# Altium project TTT4280_PCB.PrjPcb
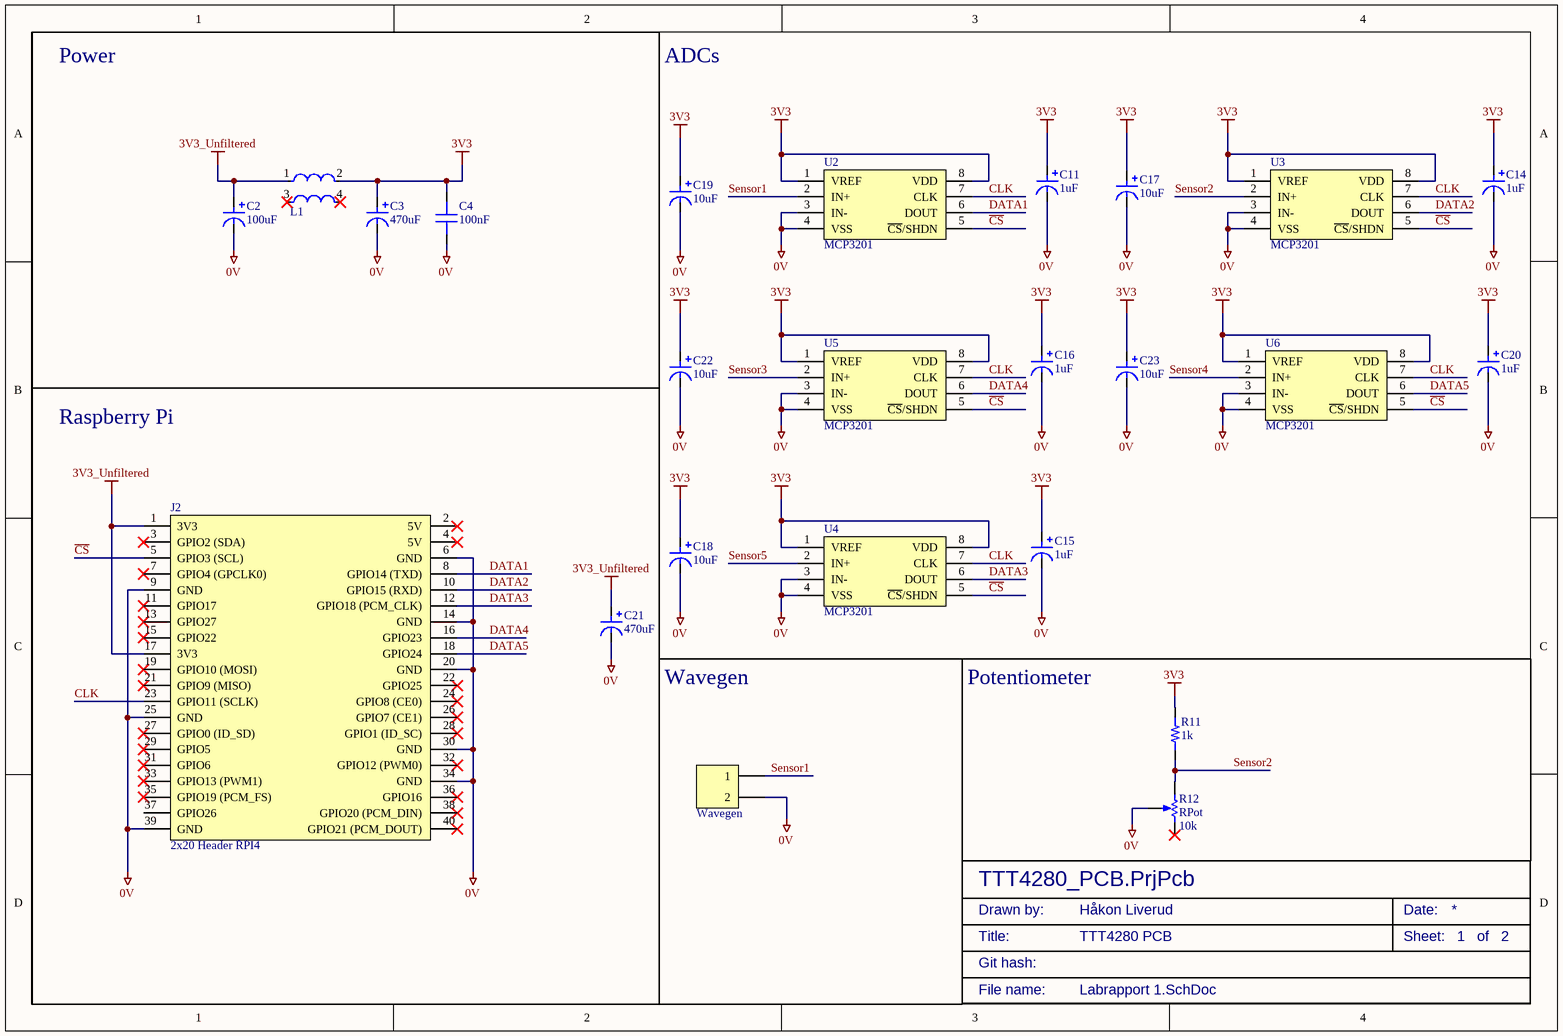
[diagram p0: Labrapport 1.SchDoc]

2 sheets, 75 parts. Net scope: global (net labels, ports and power ports of the same name join across sheets).
Board file: PCB.PcbDoc
Sheets:
  Labrapport 1.SchDoc
  Main.SchDoc

## Sheet Labrapport 1.SchDoc: TTT4280 Skjematikk
size A4; DocumentNumber: 1; SheetNumber: 1; SheetTotal: 2; DocumentTitle: TTT4280 PCB; ProjectEngineer: Håkon Liverud

### Parts
(Parts that share a designator on the sheet are numbered #1, #2 ... from top to bottom, then left to right.)
C2#1  100uF  [CTHT 5MM]
C3#1  470uF  [CTHT 8mm]
C4#1  100nF  [C TDK Film 7.3x2.5x6.5mm]
C11#1  1uF  [CTHT 4MM]
C14#1  1uF  [CTHT 4MM]
C15#1  1uF  [CTHT 4MM]
C16#1  1uF  [CTHT 4MM]
C17#1  10uF  [CTHT 4MM]
C18#1  10uF  [CTHT 4MM]
C19#1  10uF  [CTHT 4MM]
C20#1  1uF  [CTHT 4MM]
C21#1  470uF  [CTHT 8mm]
C22#1  10uF  [CTHT 4MM]
C23#1  10uF  [CTHT 4MM]
J2#1  2x20 Header RPI4  [HDRV40W87P254_2X20_5093X508X1067P]
L1#1  100mH Inductor  [DKFP-G22G-D5J0]  (value not drawn)
P1  Wavegen  [HDR1X2]
R11  1k  [R0603]
R12  RPot  value 10k  [VR5]
U2#1  MCP3201  [DIP781W56P254L950H533Q8N]
U3#1  MCP3201  [DIP781W56P254L950H533Q8N]
U4#1  MCP3201  [DIP781W56P254L950H533Q8N]
U5#1  MCP3201  [DIP781W56P254L950H533Q8N]
U6#1  MCP3201  [DIP781W56P254L950H533Q8N]

### Blocks framed on the sheet
Power: C2#1 C3#1 C4#1 L1#1
Raspberry Pi: C21#1 J2#1
Wavegen: P1
Potentiometer: R11 R12

### Nets
0V: C2#1.2 C3#1.2 C4#1.1 C11#1.2 C14#1.2 C15#1.2 C16#1.2 C17#1.2 C18#1.2 C19#1.2 C20#1.2 C21#1.2 C22#1.2 C23#1.2 J2#1.6(GND) J2#1.9(GND) J2#1.14(GND) J2#1.20(GND) J2#1.25(GND) J2#1.30(GND) J2#1.34(GND) J2#1.39(GND) P1.2 R12.3(TAP) U2#1.3(IN-) U2#1.4(VSS) U3#1.3(IN-) U3#1.4(VSS) U4#1.3(IN-) U4#1.4(VSS) U5#1.3(IN-) U5#1.4(VSS) U6#1.3(IN-) U6#1.4(VSS)
3V3: C3#1.1 C4#1.2 C11#1.1 C14#1.1 C15#1.1 C16#1.1 C17#1.1 C18#1.1 C19#1.1 C20#1.1 C22#1.1 C23#1.1 L1#1.2 R11.2 U2#1.1(VREF) U2#1.8(VDD) U3#1.1(VREF) U3#1.8(VDD) U4#1.1(VREF) U4#1.8(VDD) U5#1.1(VREF) U5#1.8(VDD) U6#1.1(VREF) U6#1.8(VDD)
3V3_Unfiltered: C2#1.1 C21#1.1 J2#1.1(3V3) J2#1.17(3V3) L1#1.1
~{CS}: J2#1.5(GPIO3_(SCL)) U2#1.5(~{CS}/SHDN) U3#1.5(~{CS}/SHDN) U4#1.5(~{CS}/SHDN) U5#1.5(~{CS}/SHDN) U6#1.5(~{CS}/SHDN)
CLK: J2#1.23(GPIO11_(SCLK)) U2#1.7(CLK) U3#1.7(CLK) U4#1.7(CLK) U5#1.7(CLK) U6#1.7(CLK)
DATA1: J2#1.8(GPIO14_(TXD)) U2#1.6(DOUT)
DATA2: J2#1.10(GPIO15_(RXD)) U3#1.6(DOUT)
DATA3: J2#1.12(GPIO18_(PCM_CLK)) U4#1.6(DOUT)
DATA4: J2#1.16(GPIO23) U5#1.6(DOUT)
DATA5: J2#1.18(GPIO24) U6#1.6(DOUT)
Sensor1: P1.1 U2#1.2(IN+)
Sensor2: R11.1 R12.1(TOP) U3#1.2(IN+)
Sensor3: U5#1.2(IN+)
Sensor4: U6#1.2(IN+)
Sensor5: U4#1.2(IN+)

Not connected (* = marked no-connect by the designer): J2#1 2(5V)* 3(GPIO2_(SDA))* 4(5V)* 7(GPIO4_(GPCLK0))* 11(GPIO17)* 13(GPIO27)* 15(GPIO22)* 19(GPIO10_(MOSI))* 21(GPIO9_(MISO))* 22(GPIO25)* 24(GPIO8_(CE0))* 26(GPIO7_(CE1))* 27(GPIO0_(ID_SD))* 28(GPIO1_(ID_SC))* 29(GPIO5)* 31(GPIO6)* 32(GPIO12_(PWM0))* 33(GPIO13_(PWM1))* 35(GPIO19_(PCM_FS))* 36(GPIO16)* 37(GPIO26) 38(GPIO20_(PCM_DIN))* 40(GPIO21_(PCM_DOUT))*; L1#1 3* 4*; R12 2(BOT)*

### Notes on the sheet
- ADCs
- Drawn by:
- Date:
- Git hash:
- Title:
- File name:

### Library data of the parts
C2#1 = 100uF 5mm THT: 100uF 5mm THT Cap
C3#1 = 470uF 8mm THT: 0.8pF 8mm THT Cap
C4#1 = 100nF Film: 100nF Film Cap; Value: 0.1uF
C11#1 C14#1 C15#1 C16#1 C20#1 = 1uF 4mm THT: 1uF 4mm THT Cap
C17#1 C18#1 C19#1 C22#1 C23#1 = 10uF 4mm THT: 10uF 4mm THT Cap
C21#1 = 470uF 8mm THT: 100uF 8mm THT Cap
J2#1 = 2222_1: GPIO MALE HEADER RASPBERRY PI
L1#1 = DKFP-G22G-D5J0: Common Mode Chokes / Filters DKFP COMP.CHOKE THT P O 0.5A 2X100mH
P1 = Header 2: Header, 2-Pin; LatestRevisionDate: 17-Jul-2002; LatestRevisionNote: Re-released for DXP Platform.; Publisher: Altium Limited
R11 = 10k 0603: 10k 0603 Res; Value: 1K
R12 = RPot: Potentiometer; Sim Note: Enter the Resistance value and the set point into parameter fields.; Set Position: 0.5; Published: 8-Jun-2000; LatestRevisionDate: 17-Jul-2002; LatestRevisionNote: Re-released for DXP Platform.; PackageReference: VR5; Publisher: Altium Limited; PackageDescription: Variable Resistor, Thru-Hole; 3 Leads
U2#1 U3#1 U4#1 U5#1 U6#1 = MCP3201-BI_P: 12-Bit, 100kSPS, Single Channel ADC; Manufacturer_Name: Microchip; Manufacturer_Part_Number: MCP3201-BI/P; Datasheet Link: http://uk.rs-online.com/web/p/products/1654833; Height: 5.334mm; Mouser Part Number: 579-MCP3201-BI/P; Mouser Price/Stock: https://www.mouser.co.uk/ProductDetail/Microchip-Technology-Atmel/MCP3201-BI-P?qs=Vn0zuzr35GGoo291EIbsHA%3D%3D; Arrow Part Number: MCP3201-BI/P; Arrow Price/Stock: https://www.arrow.com/en/products/mcp3201-bip/microchip-technology?region=nac

## Sheet Main.SchDoc: TTT4280 PCB
size A3; DocumentNumber: 1; SheetNumber: 2; SheetTotal: 2; DocumentTitle: TTT4280 PCB; ProjectEngineer: Håkon Liverud
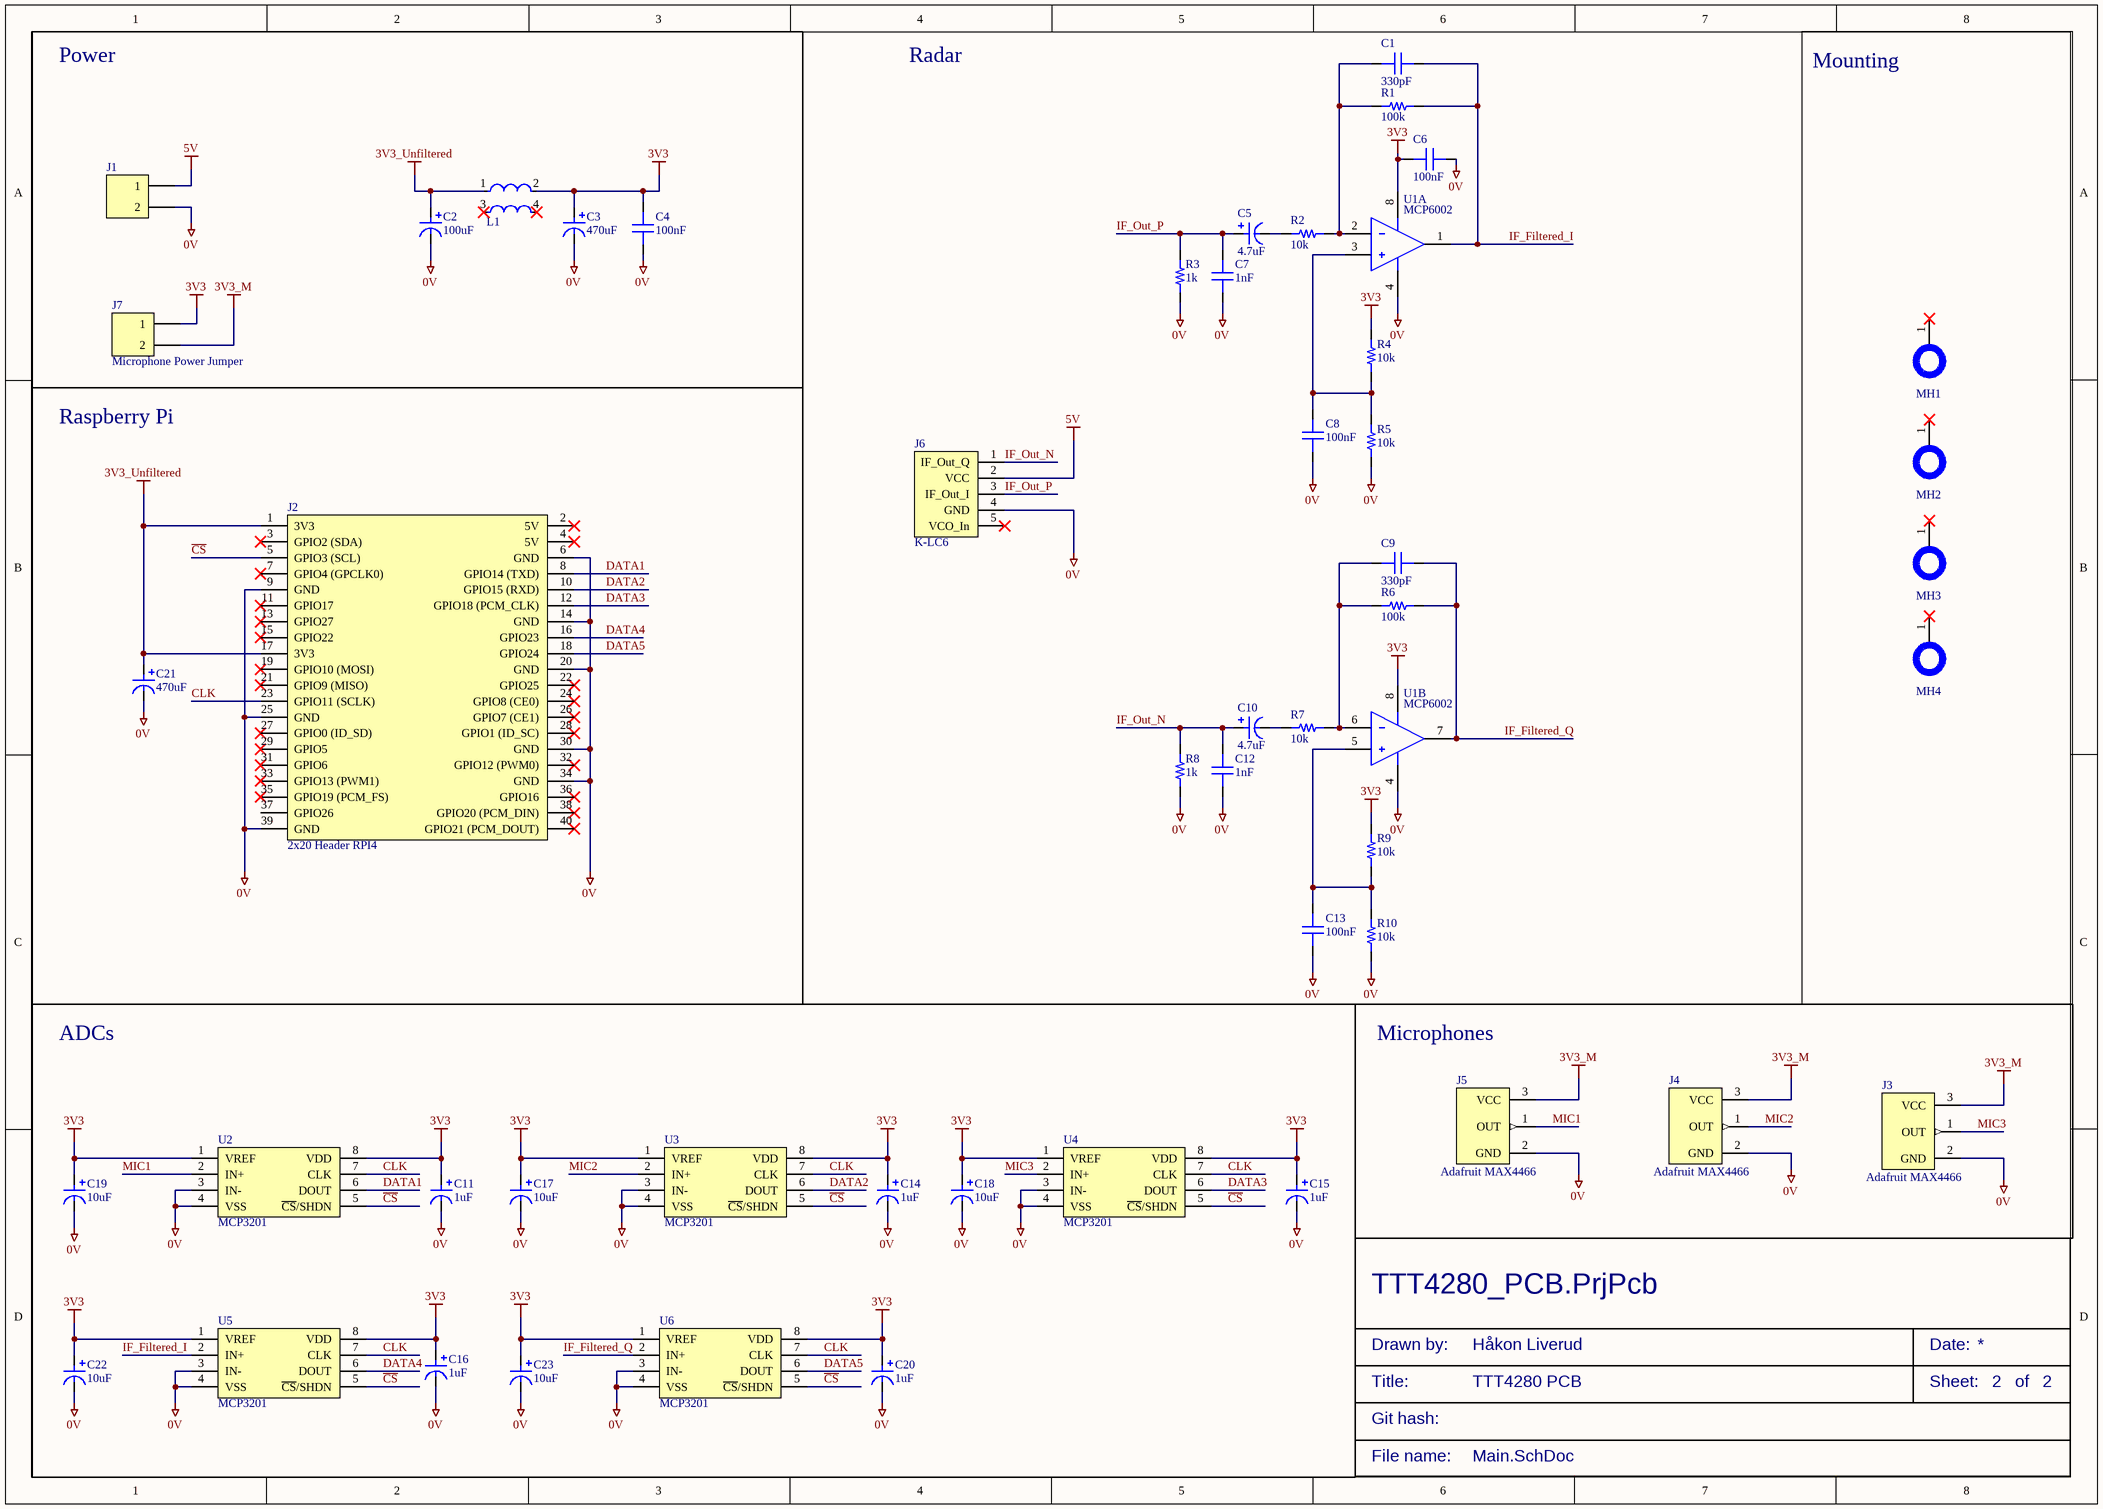
[diagram p1: Main.SchDoc]

### Parts
(Parts that share a designator on the sheet are numbered #1, #2 ... from top to bottom, then left to right.)
C1  330pF  [CTHT Ceramic]
C2#2  100uF  [CTHT 5MM]
C3#2  470uF  [CTHT 8mm]
C4#2  100nF  [C TDK Film 7.3x2.5x6.5mm]
C5  4.7uF  [CTHT 5MM]
C6  100nF  [C TDK Film 7.3x2.5x6.5mm]
C7  1nF  [CTHT Ceramic]
C8  100nF  [C TDK Film 7.3x2.5x6.5mm]
C9  330pF  [CTHT Ceramic]
C10  4.7uF  [CTHT 5MM]
C11#2  1uF  [CTHT 4MM]
C12  1nF  [CTHT Ceramic]
C13  100nF  [C TDK Film 7.3x2.5x6.5mm]
C14#2  1uF  [CTHT 4MM]
C15#2  1uF  [CTHT 4MM]
C16#2  1uF  [CTHT 4MM]
C17#2  10uF  [CTHT 4MM]
C18#2  10uF  [CTHT 4MM]
C19#2  10uF  [CTHT 4MM]
C20#2  1uF  [CTHT 4MM]
C21#2  470uF  [CTHT 8mm]
C22#2  10uF  [CTHT 4MM]
C23#2  10uF  [CTHT 4MM]
J1  Header 2  [HDR1X2]  (value not drawn)
J2#2  2x20 Header RPI4  [HDRV40W87P254_2X20_5093X508X1067P]
J3  Adafruit MAX4466  [MODULE_1063]
J4  Adafruit MAX4466  [MODULE_1063]
J5  Adafruit MAX4466  [MODULE_1063]
J6  K-LC6  [K-LC6]
J7  Microphone Power Jumper  [HDR1X2]
L1#2  100mH Inductor  [DKFP-G22G-D5J0]  (value not drawn)
MH1  MountingHole  [MountingHole]  (value not drawn)
MH2  MountingHole  [MountingHole]  (value not drawn)
MH3  MountingHole  [MountingHole]  (value not drawn)
MH4  MountingHole  [MountingHole]  (value not drawn)
R1  100k  [RTHT]
R2  10k  [RTHT]
R3  1k  [RTHT]
R4  10k  [RTHT]
R5  10k  [RTHT]
R6  100k  [RTHT]
R7  10k  [RTHT]
R8  1k  [RTHT]
R9  10k  [RTHT]
R10  10k  [RTHT]
U1  MCP6002  [DIP781W56P254L950H533Q8N]  (parts A,B of 2)
U2#2  MCP3201  [DIP781W56P254L950H533Q8N]
U3#2  MCP3201  [DIP781W56P254L950H533Q8N]
U4#2  MCP3201  [DIP781W56P254L950H533Q8N]
U5#2  MCP3201  [DIP781W56P254L950H533Q8N]
U6#2  MCP3201  [DIP781W56P254L950H533Q8N]

### Blocks framed on the sheet
Power: C2#2 C3#2 C4#2 J1 J7 L1#2
Mounting: MH1-MH4
Raspberry Pi: C21#2 J2#2
ADCs: C11#2 C14#2 C15#2 C16#2 C17#2 C18#2 C19#2 C20#2 C22#2 C23#2 U2#2 U3#2 U4#2 U5#2 U6#2
Microphones: J3-J5

### Nets
0V: C2#2.2 C3#2.2 C4#2.1 C6.1 C7.1 C8.1 C11#2.2 C12.1 C13.1 C14#2.2 C15#2.2 C16#2.2 C17#2.2 C18#2.2 C19#2.2 C20#2.2 C21#2.2 C22#2.2 C23#2.2 J1.2 J2#2.6(GND) J2#2.9(GND) J2#2.14(GND) J2#2.20(GND) J2#2.25(GND) J2#2.30(GND) J2#2.34(GND) J2#2.39(GND) J3.2(GND) J4.2(GND) J5.2(GND) J6.4(GND) R3.1 R5.1 R8.1 R10.1 U1.4(VSS) U2#2.3(IN-) U2#2.4(VSS) U3#2.3(IN-) U3#2.4(VSS) U4#2.3(IN-) U4#2.4(VSS) U5#2.3(IN-) U5#2.4(VSS) U6#2.3(IN-) U6#2.4(VSS)
3V3: C3#2.1 C4#2.2 C6.2 C11#2.1 C14#2.1 C15#2.1 C16#2.1 C17#2.1 C18#2.1 C19#2.1 C20#2.1 C22#2.1 C23#2.1 J7.1 L1#2.2 R4.2 R9.2 U1.8(VDD) U2#2.1(VREF) U2#2.8(VDD) U3#2.1(VREF) U3#2.8(VDD) U4#2.1(VREF) U4#2.8(VDD) U5#2.1(VREF) U5#2.8(VDD) U6#2.1(VREF) U6#2.8(VDD)
3V3_M: J3.3(VCC) J4.3(VCC) J5.3(VCC) J7.2
3V3_Unfiltered: C2#2.1 C21#2.1 J2#2.1(3V3) J2#2.17(3V3) L1#2.1
5V: J1.1 J6.2(VCC)
~{CS}: J2#2.5(GPIO3_(SCL)) U2#2.5(~{CS}/SHDN) U3#2.5(~{CS}/SHDN) U4#2.5(~{CS}/SHDN) U5#2.5(~{CS}/SHDN) U6#2.5(~{CS}/SHDN)
CLK: J2#2.23(GPIO11_(SCLK)) U2#2.7(CLK) U3#2.7(CLK) U4#2.7(CLK) U5#2.7(CLK) U6#2.7(CLK)
DATA1: J2#2.8(GPIO14_(TXD)) U2#2.6(DOUT)
DATA2: J2#2.10(GPIO15_(RXD)) U3#2.6(DOUT)
DATA3: J2#2.12(GPIO18_(PCM_CLK)) U4#2.6(DOUT)
DATA4: J2#2.16(GPIO23) U5#2.6(DOUT)
DATA5: J2#2.18(GPIO24) U6#2.6(DOUT)
IF_Filtered_I: C1.2 R1.1 U1.1(VOUTA) U5#2.2(IN+)
IF_Filtered_Q: C9.2 R6.1 U1.7(VOUTB) U6#2.2(IN+)
IF_Out_N: C10.1 C12.2 J6.1(IF_Out_Q) R8.2
IF_Out_P: C5.1 C7.2 J6.3(IF_Out_I) R3.2
MIC1: J5.1(OUT) U2#2.2(IN+)
MIC2: J4.1(OUT) U3#2.2(IN+)
MIC3: J3.1(OUT) U4#2.2(IN+)
NetC1_1: C1.1 R1.2 R2.1 U1.2(VINA-)
NetC5_2: C5.2 R2.2
NetC8_2: C8.2 R4.1 R5.2 U1.3(VINA+)
NetC9_1: C9.1 R6.2 R7.1 U1.6(VINB-)
NetC10_2: C10.2 R7.2
NetC13_2: C13.2 R9.1 R10.2 U1.5(VINB+)

Not connected (* = marked no-connect by the designer): J2#2 2(5V)* 3(GPIO2_(SDA))* 4(5V)* 7(GPIO4_(GPCLK0))* 11(GPIO17)* 13(GPIO27)* 15(GPIO22)* 19(GPIO10_(MOSI))* 21(GPIO9_(MISO))* 22(GPIO25)* 24(GPIO8_(CE0))* 26(GPIO7_(CE1))* 27(GPIO0_(ID_SD))* 28(GPIO1_(ID_SC))* 29(GPIO5)* 31(GPIO6)* 32(GPIO12_(PWM0))* 33(GPIO13_(PWM1))* 35(GPIO19_(PCM_FS))* 36(GPIO16)* 37(GPIO26) 38(GPIO20_(PCM_DIN))* 40(GPIO21_(PCM_DOUT))*; J6 5(VCO_In)*; L1#2 3* 4*; MH1 1(Hole)*; MH2 1(Hole)*; MH3 1(Hole)*; MH4 1(Hole)*

### Notes on the sheet
- Radar
- Drawn by:
- Title:
- Date:
- File name:
- Git hash:

### Library data of the parts
C1 C9 = 1nF Ceramic: 330pF Ceramic Cap; Value: 1nF
C2#2 = 100uF 5mm THT: 100uF 5mm THT Cap
C3#2 = 470uF 8mm THT: 0.8pF 8mm THT Cap
C4#2 C6 C8 C13 = 100nF Film: 100nF Film Cap; Value: 0.1uF
C5 C10 = 100uF 5mm THT: 4.7uF 5mm THT Cap
C7 C12 = 1nF Ceramic: 1nF Ceramic Cap; Value: 1nF
C11#2 C14#2 C15#2 C16#2 C20#2 = 1uF 4mm THT: 1uF 4mm THT Cap
C17#2 C18#2 C19#2 C22#2 C23#2 = 10uF 4mm THT: 10uF 4mm THT Cap
C21#2 = 470uF 8mm THT: 100uF 8mm THT Cap
J1 J7 = Header 2: Header, 2-Pin; LatestRevisionDate: 17-Jul-2002; LatestRevisionNote: Re-released for DXP Platform.; Publisher: Altium Limited
J2#2 = 2222_1: GPIO MALE HEADER RASPBERRY PI
J3-J5 = 1063: Microphone Pre-Amp Audio Evaluation Board; MF: {'manufacturer': u'Adafruit'}; Price: None; Availability: Unavailable; MP: 1063; Value: *; Package: None
J6 = K-LC6: Radar Transceiver Module 24.05GHz ~ 24.25GHz Integrated, Ceramic Patch Through Hole; LatestRevisionDate: 17-Jul-2002; LatestRevisionNote: Re-released for DXP Platform.; Publisher: Altium Limited
L1#2 = DKFP-G22G-D5J0: as L1#1 on sheet Labrapport 1
MH1-MH4 = MountingHole: 3.5mm mounting hole
R1 R6 = 1k THT: 100k THT Res; Value: 1K
R2 R4 R5 R7 R9 R10 = 1k THT: 10k THT Res; Value: 1K
R3 R8 = 1k THT: 1k THT Res; Value: 1K
U1 = MCP6022-P-8: Operational Amplifiers - Op Amps Dual 1.8V 1MHz
U2#2 U3#2 U4#2 U5#2 U6#2 = MCP3201-BI_P: as U2#1 on sheet Labrapport 1; Datasheet Link: http://uk.rs-online.com/web/p/products/1654833; Height: 5.334mm; Mouser Part Number: 579-MCP3201-BI/P; Mouser Price/Stock: https://www.mouser.co.uk/ProductDetail/Microchip-Technology-Atmel/MCP3201-BI-P?qs=Vn0zuzr35GGoo291EIbsHA%3D%3D; Arrow Part Number: MCP3201-BI/P; Arrow Price/Stock: https://www.arrow.com/en/products/mcp3201-bip/microchip-technology?region=nac

## Nets that join several sheets
0V: Labrapport 1 (34 pins), Main (47 pins)
3V3: Labrapport 1 (24 pins), Main (28 pins)
3V3_Unfiltered: Labrapport 1 (5 pins), Main (5 pins)
~{CS}: Labrapport 1 (6 pins), Main (6 pins)
CLK: Labrapport 1 (6 pins), Main (6 pins)
DATA1: Labrapport 1 (J2#1.8 U2#1.6), Main (J2#2.8 U2#2.6)
DATA2: Labrapport 1 (J2#1.10 U3#1.6), Main (J2#2.10 U3#2.6)
DATA3: Labrapport 1 (J2#1.12 U4#1.6), Main (J2#2.12 U4#2.6)
DATA4: Labrapport 1 (J2#1.16 U5#1.6), Main (J2#2.16 U5#2.6)
DATA5: Labrapport 1 (J2#1.18 U6#1.6), Main (J2#2.18 U6#2.6)

## Assembly variants
Default: all parts fitted